# Altium schematic sheet SensorShield.SchDoc
size A4; DocumentNumber: 1; Revision: 0.1; SheetNumber: 1; SheetTotal: 1; HTL_Gruppe: I; HTL_Klasse: Klasse; HTL_Zusaetzlicher_Titel: zusätzlicher Titel; HTL_Schueler_Name: Max Mustermann; PageSetup: Record=PageOptions|CenterHorizontal=True|CenterVertical=True|PrintScale=1.00|XCorrection=1.00|YCorrection=1.00|PrintKind=0|BorderSize=5000000|LeftOffset=0|BottomOffset=0|Orientation=2|PaperLength=1000|PaperWidth=1000|Scale=100|PaperSource=7|PrintQuality=-4|MediaType=1|DitherType=10|PaperKind=A4|PrintScaleMode=1; HTL_Projektname: Projektname; HTL_Dokumentenart: Dokumentenart; HTL_Dokumentenstatus: Dokumentenstatus
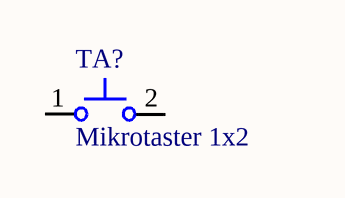
[diagram p0: SensorShield.SchDoc]

## Parts
TA?  Mikrotaster 1x2  [SW_DTSM-61NT/R - 1x2]

## Nets

Not connected (* = marked no-connect by the designer): TA? 1 2

## Notes on the sheet
- Sachnummer / Dateiname:
- Name:
- Gruppe:
- Klasse:
- Elektronik &
- Technische Informatik
- Anichstraße 26 - 28
- HTBLVA
- Titel:
- Datum:
- Dokumentenart:
- Dokumentenstatus:
- A - 6020 Innsbruck
- Ver.:
- Blatt:
- Blätter:

## Library data of the parts
TA? = Mikrotaster 1x2: Mikrotaster 1x2; max DC 50V; Usage: only permitted for non-commercial purposes at HTL I Innsbruck; SimulationModellSource: <No SimModell found so far>; Published: 29-Mar-2017; LatestRevisionDate: 07-Sep-2019; Publisher: Michael Kupfner